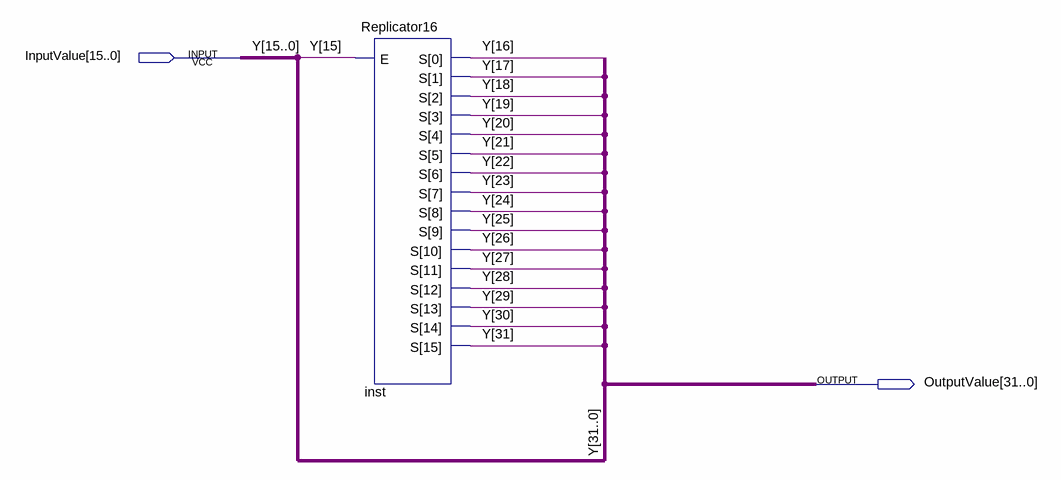
[diagram p0: schematic sheet]
// Quartus schematic SignExtensor.bdf as structural Verilog: 1 symbols, 2 pins
module SignExtensor (
  input  [15:0] InputValue,
  output [31:0] OutputValue
);

  Replicator16 inst (.E(InputValue[15]), .S(OutputValue[31:16]));

  assign OutputValue[15:0] = InputValue;

  // Other names for the same wires on the sheet: Y[31:0] = {OutputValue[31:16], InputValue}
endmodule
